# EasyEDA Pro project ProPrj_smart toll system_2026-01-20.epro

# Schematic Schematic1
Board Name: Board1; Create Date: 2025-05-15; Page Name: P1; Project Name: smart toll system; Schematic Name: Schematic1; Update Date: 2025-07-16; Company: EasyEDA.com; Page Size: A4; Version: V1.0
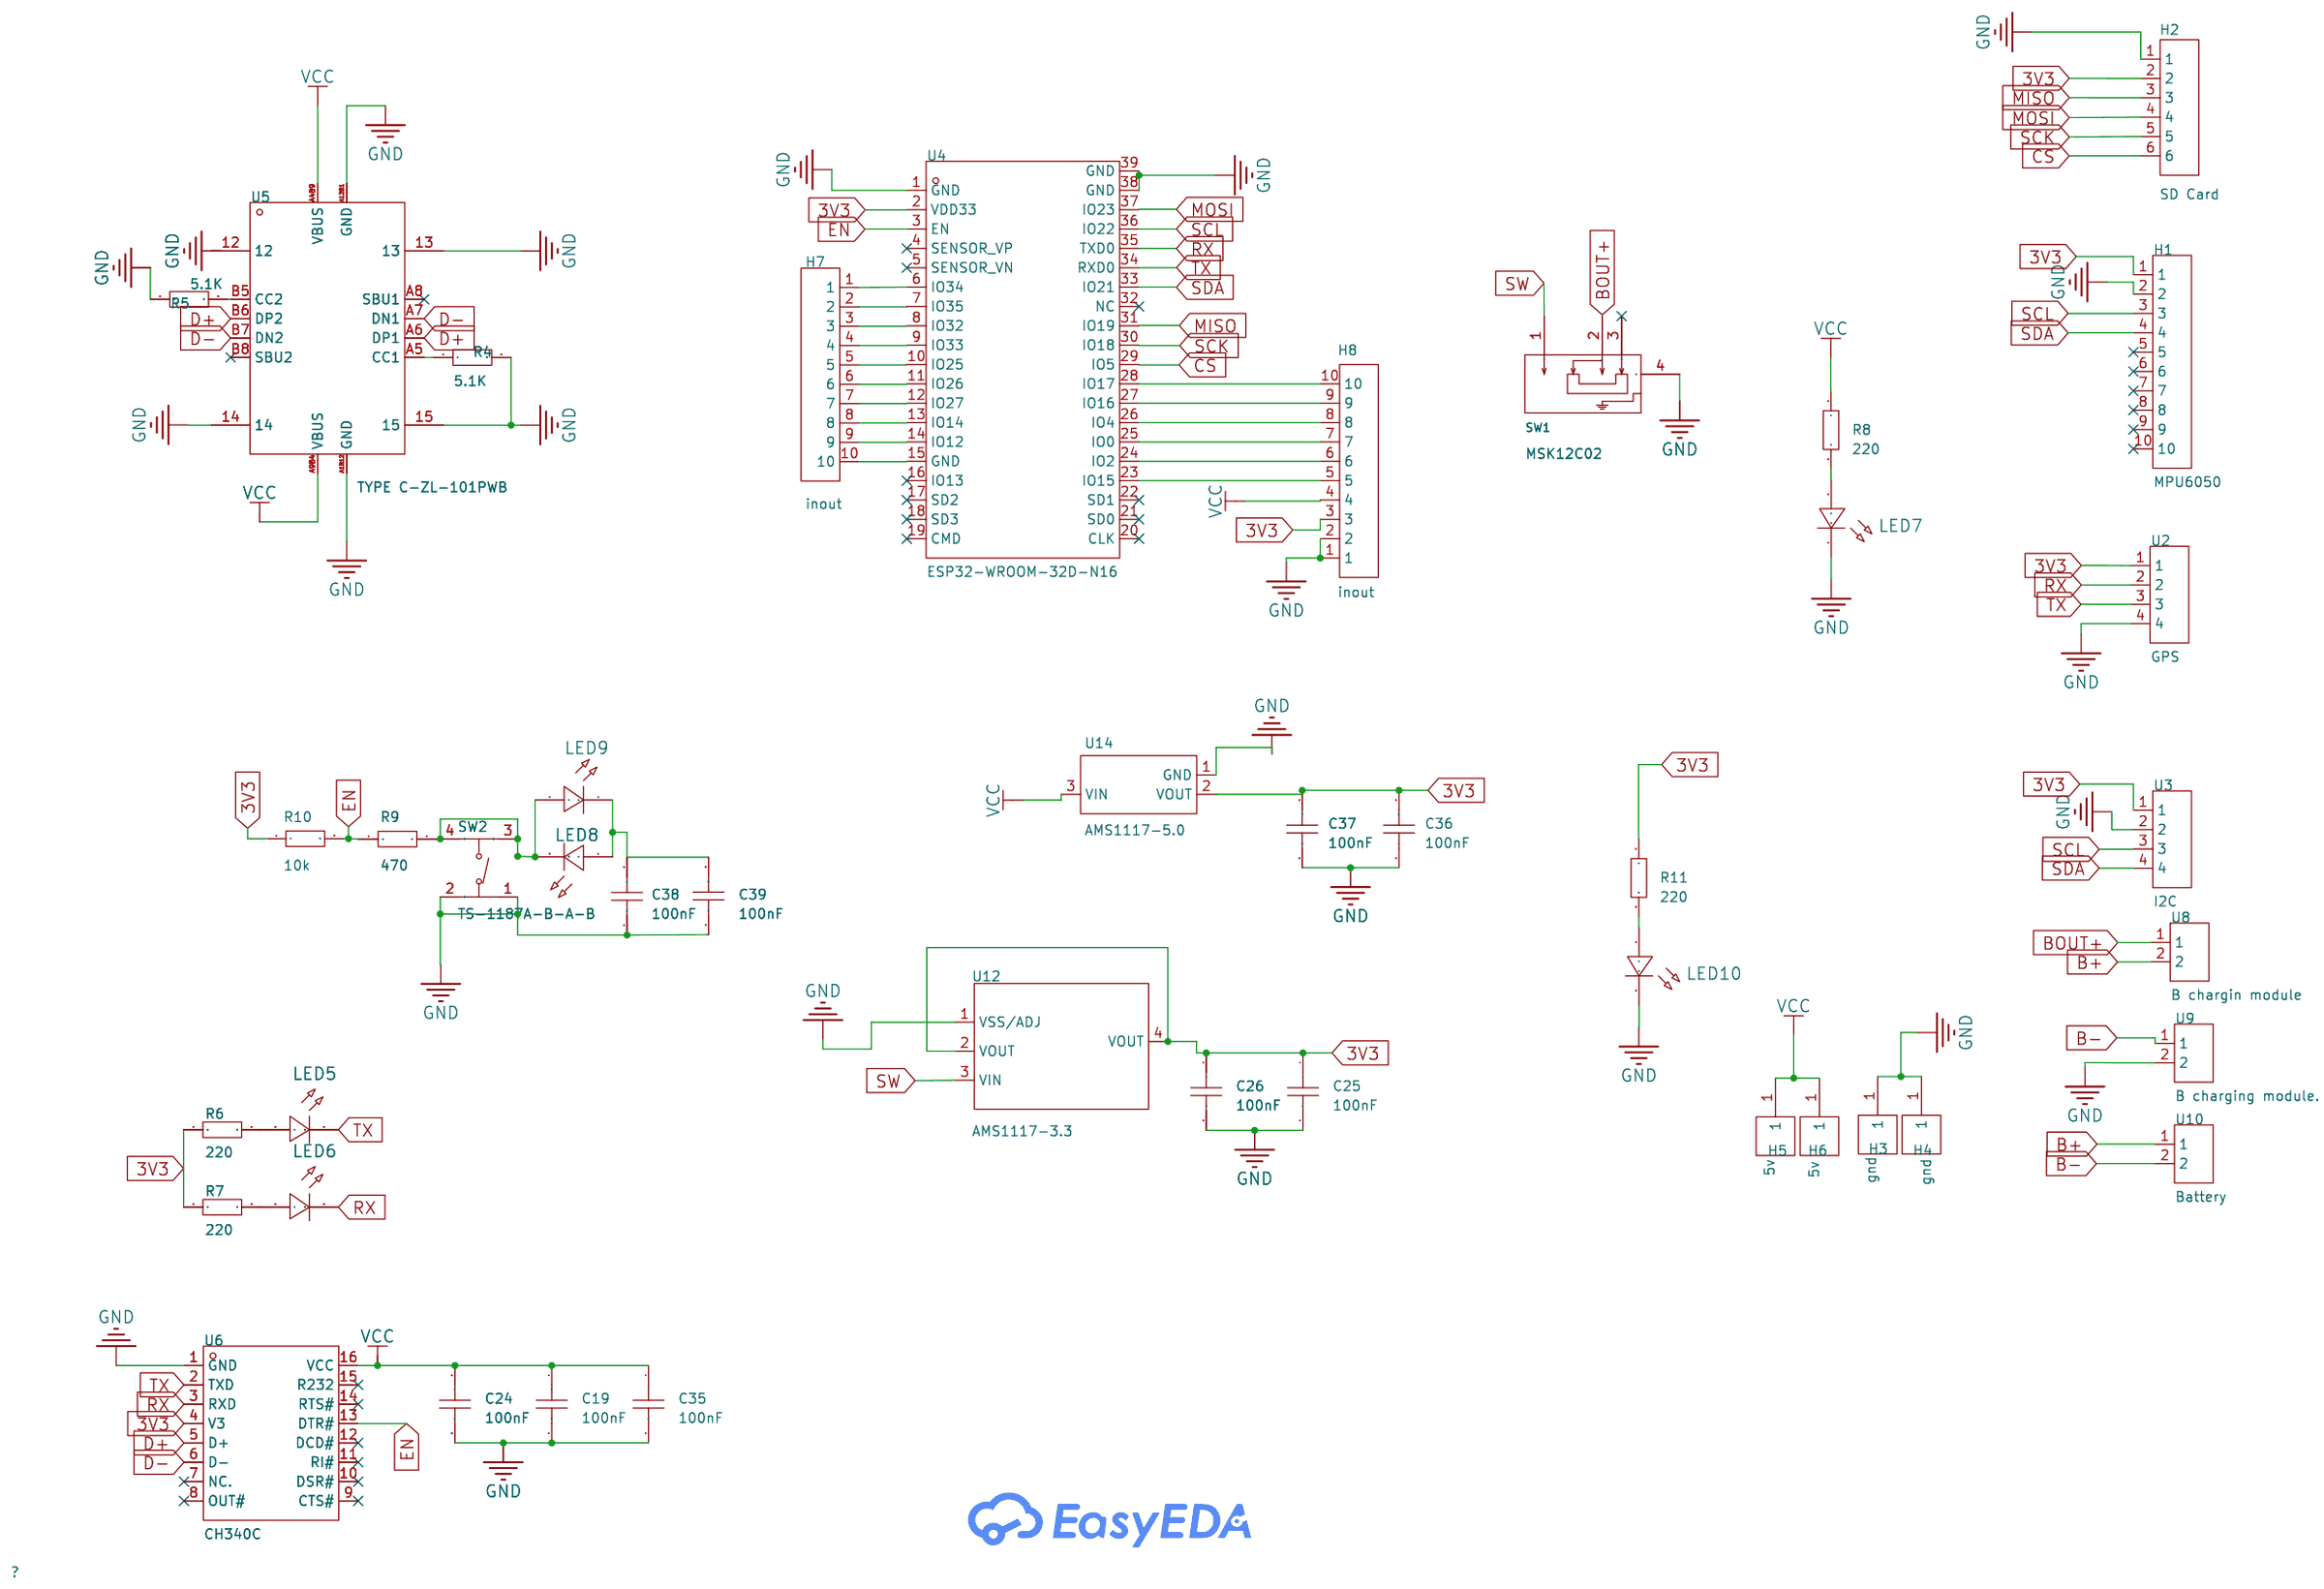
[diagram p0: schematic sheet]

## Parts
C19  100nF  [C0805]
C24  100nF  [C0805]
C25  100nF  [C0805]
C26  100nF  [C0805]
C35  100nF  [C0805]
C36  100nF  [C0805]
C37  100nF  [C0805]
C38  100nF  [C0805]
C39  100nF  [C0805]
H1  MPU6050  [HDR-TH_10P-P2.54-V-M]
H2  SD Card  [HDR-TH_6P-P2.54-V-M]
H3  gnd  [HDR-TH_1P-P2.54-V-M]
H4  gnd  [HDR-TH_1P-P2.54-V-M]
H5  5v  [HDR-TH_1P-P2.54-V-M]
H6  5v  [HDR-TH_1P-P2.54-V-M]
H7  inout  [HDR-TH_10P-P2.54-V-M]
H8  inout  [HDR-TH_10P-P2.54-V-M]
LED5  -  [LED0402-RD_YELLOW]
LED6  -  [LED0402-RD_YELLOW]
LED7  -  [LED0402-RD_YELLOW]
LED8  -  [LED0402-RD_YELLOW]
LED9  -  [LED0402-RD_YELLOW]
LED10  -  [LED0402-RD_YELLOW]
R4  5.1K  [R0603]
R5  5.1K  [R0603]
R6  220  [R0603]
R7  220  [R0603]
R8  220  [R0603]
R9  470  [R0603]
R10  10k  [R0603]
R11  220  [R0603]
SW1  MSK12C02  [SW-TH_MSK12C02]
SW2  TS-1187A-B-A-B  [SW-SMD_4P-L5.1-W5.1-P3.70-LS6.5-TL_H1.5]
U2  GPS  [HDR-TH_4P-P2.54-V-M]
U3  I2C  [HDR-TH_4P-P2.54-V-M]
U4  ESP32-WROOM-32D-N16  [WIFIM-SMD_39P-L25.5-W18.0-P1.27-BL]
U5  TYPE C-ZL-101PWB  [TYPE-C-SMD_HDGC_TYPE-C-ZL-101PWB]
U6  CH340C  [SOP-16_L10.0-W3.9-P1.27-LS6.0-BL]
U8  B chargin module  [HDR-TH_2P-P2.54-V-M]
U9  B charging module.  [HDR-TH_2P-P2.54-V-M]
U10  Battery  [HDR-TH_2P-P2.54-V-M]
U12  AMS1117-3.3  [SOT-223-3_L6.4-W3.5-P2.30-LS7.0-BR]
U14  AMS1117-5.0  [SOT-223-3_L6.7-W3.7-P2.30-LS7.0-BR_2]

## Library data of the parts
C19 C24-C26 C35-C39 = CAP_0805: Supplier Footprint: 0805
H1 H7 H8 = PZ254V-11-10P: Pin Structure:1x10P Pitch:2.54mm Row Spacing:- Circluar Pins/Square Pins:Policy Mounting Type:Straight Number of Rows:Single Row Number of Pins:10P Current Rating:- Voltage Rating (Max):- Length of Mating Pin:6mm Insulation Height:2.5mm Length of End Conn; LCSC Part Name: 1x10P 间距:2.54mm 方针 直插; Supplier Part: C492409; Manufacturer: XFCN(兴飞); Supplier Footprint: 插件,P=2.54mm; JLCPCB Part Class: Extended Part; Datasheet: https://atta.szlcsc.com/upload/public/pdf/source/20200309/C492409_129C9431BDD62EBBBD0A643B6AAB9FBD.pdf; Supplier: LCSC; Pin Structure: 1x10P; Pitch: 2.54mm; Circluar Pins/Square Pins: Policy; Mounting Type: Straight; Number of Rows: Single Row; Number of Pins: 10P; Length of Mating Pin: 6mm; Insulation Height: 2.5mm; Length of End Connection Pin: 3mm; Contact Material: Brass; Operating Temperature: -40℃~+105℃; Color: Black
H2 = PZ254V-11-06P: Pin Structure:1x6P Pitch:2.54mm Row Spacing:- Circluar Pins/Square Pins:Policy Mounting Type:Straight Number of Rows:Single Row Number of Pins:6P Current Rating:- Voltage Rating (Max):- Length of Mating Pin:6mm Insulation Height:2.5mm Length of End Connec; LCSC Part Name: 1x6P 间距:2.54mm 方针 直插; Supplier Part: C492405; Manufacturer: XFCN(兴飞); Supplier Footprint: 插件,P=2.54mm; JLCPCB Part Class: Extended Part; Datasheet: https://atta.szlcsc.com/upload/public/pdf/source/20200309/C492405_597F1930F5B55CC3C7FD95458F1C3977.pdf; Supplier: LCSC; Pin Structure: 1x6P; Pitch: 2.54mm; Circluar Pins/Square Pins: Policy; Mounting Type: Straight; Number of Rows: Single Row; Number of Pins: 6P; Length of Mating Pin: 6mm; Insulation Height: 2.5mm; Length of End Connection Pin: 3mm; Contact Material: Brass; Operating Temperature: -40℃~+105℃; Color: Black
H3-H6 = PZ254V-11-01P: Pin Structure:1x1P Pitch:2.54mm Row Spacing:- Circluar Pins/Square Pins:Policy Mounting Type:Straight Number of Rows:Single Row Number of Pins:1P Current Rating:- Voltage Rating (Max):- Length of Mating Pin:6mm Insulation Height:2.5mm Length of End Connec; LCSC Part Name: 1x1P 间距:2.54mm 方针 直插; Supplier Part: C492400; Manufacturer: XFCN(兴飞); Supplier Footprint: 插件,P=2.54mm; JLCPCB Part Class: Extended Part; Datasheet: https://atta.szlcsc.com/upload/public/pdf/source/20200309/C492400_46876A5B545F5AE6B8D4A09C46E276E8.pdf; Supplier: LCSC; Pin Structure: 1x1P; Pitch: 2.54mm; Circluar Pins/Square Pins: Policy; Mounting Type: Straight; Number of Rows: Single Row; Number of Pins: 1P; Length of Mating Pin: 6mm; Insulation Height: 2.5mm; Length of End Connection Pin: 3mm; Contact Material: Brass; Operating Temperature: -40℃~+105℃; Color: Black
LED5-LED10 = LED_0402-R: Supplier Footprint: 0402
R4-R11 = Res_0603: Supplier Footprint: 0603
SW1 = MSK12C02: Circuit:SPDT Actuator Style:- Pin Style:SMDSplicing Switch Length:8mm Switch Width:2.8mm Switch Height:1.4mm Mounting Style:卧贴 Actuator Color:- Current Rating (DC):50mA Voltage Rating (DC):12V Current Rating (AC):- Voltage Rating (AC):- Mechanical Life:1万; LCSC Part Name: 两档侧拨贴片 7脚 滑动开关; Supplier Part: C431540; Manufacturer: SHOU HAN(首韩); Supplier Footprint: SMD; JLCPCB Part Class: Extended Part; Datasheet: https://atta.szlcsc.com/upload/public/pdf/source/20190925/C431540_89155AEF0758B9AD1B2D805F83FB12E3.pdf; Supplier: LCSC; Circuit: SPDT; Pin Style: SMDSplicing; Switch Length: 8mm; Switch Width: 2.8mm; Switch Height: 1.4mm; Mounting Style: 卧贴; Current Rating (DC): 50mA; Voltage Rating (DC): 12V; Mechanical Life: 1万次; Operating Temperature: -20℃~+70℃
SW2 = TS-1187A-B-A-B: Circuit:SPST Actuator Style:Round Button Operating Force:160gf Mounting Style:Brick nogging Switch Length:5.1mm Switch Width:5.1mm Switch Height:1.5mm Strike Gundam:不带 Contact Current:50mA Voltage Rating (DC):12V Insulation Resistance:- Actuator/Cap Color; LCSC Part Name: 5.1*5.1*1.5mm 立贴 轻触开关; Supplier Part: C318884; Manufacturer: XKB Connectivity(中国星坤); Supplier Footprint: SMD; JLCPCB Part Class: Basic Part; Datasheet: https://atta.szlcsc.com/upload/public/pdf/source/20200227/C318890_053E50208A88A7BA1965D8746000774E.pdf; Supplier: LCSC; Circuit: SPST; Actuator Style: Round Button; Operating Force: 160gf; Mounting Style: Brick nogging; Switch Length: 5.1mm; Switch Width: 5.1mm; Switch Height: 1.5mm; Strike Gundam: 不带; Contact Current: 50mA; Voltage Rating (DC): 12V; Actuator/Cap Color: 金色; With Lamp: No; Mechanical Life: 10万次; Operating Temperature: -30℃~+85℃
U2 U3 = HB-PH3-25414PB2GOP: Pin Structure:1x4P Pitch:2.54mm Row Spacing:2.54mm Circluar Pins/Square Pins:Policy Mounting Type:Straight Number of Rows:Single Row Number of Pins:4P Current Rating:3A Voltage Rating (Max):250V Length of Mating Pin:6mm Insulation Height:2.54mm Length of; LCSC Part Name: 1x4P 间距:2.54mm 方针 直插; Supplier Part: C6332197; Manufacturer: HANBO(汉博); Supplier Footprint: 插件,P=2.54mm; JLCPCB Part Class: Extended Part; Datasheet: https://atta.szlcsc.com/upload/public/pdf/source/20230803/F72D259687963761DF1B552F3BB84A31.pdf; Supplier: LCSC; Pin Structure: 1x4P; Pitch: 2.54mm; Row Spacing: 2.54mm; Circluar Pins/Square Pins: Policy; Mounting Type: Straight; Number of Rows: Single Row; Number of Pins: 4P; Current Rating: 3A; Voltage Rating (Max): 250V; Length of Mating Pin: 6mm; Insulation Height: 2.54mm; Length of End Connection Pin: 3mm; Contact Material: Brass; Contact Plating: Gold; Operating Temperature: -40℃~+105℃; Color: Black
U4 = ESP32-WROOM-32D-N16: LCSC Part Name: 通用型Wi-Fi+BT+BLE MCU模组; Supplier Part: C529578; Manufacturer: ESPRESSIF(乐鑫); Supplier Footprint: SMD,18x25.5mm; JLCPCB Part Class: Extended Part; Datasheet: https://atta.szlcsc.com/upload/public/pdf/source/20200521/C529577_90A62DBC94C4A28650A646C18DE51576.pdf; Supplier: LCSC
U5 = TYPE C-ZL-101PWB: Connector Type:Type-C Number of Contacts:16P; LCSC Part Name: Type-C; Supplier Part: C5273949; Manufacturer: HDGC(华德共创); Supplier Footprint: SMD; JLCPCB Part Class: Extended Part; Datasheet: https://atta.szlcsc.com/upload/public/pdf/source/20221121/C466F9DBEFE7C046EDC432E7A2CA17E2.pdf; Supplier: LCSC; Connector Type: Type-C; Number of Contacts: 16P
U6 = CH340C: Applications Function:Transceiver Protocol: Supply Voltage:3.3V；5V Supply Voltage:3.3V；5V Data Rate:2Mbps; LCSC Part Name: CH340C USB转串口芯片 CH340; Supplier Part: C84681; Manufacturer: WCH(南京沁恒); Supplier Footprint: SOP-16; JLCPCB Part Class: Extended Part; Datasheet: https://atta.szlcsc.com/upload/public/pdf/source/20240619/63986D8440D4E5267A77ACD891CC4DE3.pdf; Supplier: LCSC; Applications Function: Transceiver; Supply Voltage: 3.3V；5V; Data Rate: 2Mbps
U8-U10 = DS1021-1x2SF11-B: Pin Structure:1x2P Pitch:2.54mm Mounting Type:Straight Number of Rows:Single Row Number of Pins:2P; LCSC Part Name: 1x2P 间距:2.54mm 直插; Supplier Part: C7430358; Manufacturer: CONNFLY; Supplier Footprint: 插件,P=2.54mm; JLCPCB Part Class: Extended Part; Datasheet: https://atta.szlcsc.com/upload/public/pdf/source/20241114/4CD35FDA5D93B3DA0275EC4D3D55EAE2.pdf; Supplier: LCSC; Pin Structure: 1x2P; Pitch: 2.54mm; Mounting Type: Straight; Number of Rows: Single Row; Number of Pins: 2P
U12 = AMS1117-3.3_C5181460: Output Type:Fixed Voltage - Supply:18V Output Voltage:3.3V Output Voltage:3.3V Output Current:1A Power Supply Rejection Ratio (PSRR):- Features:热关断(TSD) Operating Temperature:-20℃~+85℃@(Ta) Operating Temperature:-20℃~+85℃@(Ta) Output Configuration:Positiv; Supplier Part: C5181460; Manufacturer: HX(恒佳兴); Supplier Footprint: SOT-223; JLCPCB Part Class: Extended Part; Datasheet: https://atta.szlcsc.com/upload/public/pdf/source/20221124/A0FC4A7547BAED3AF8F477D5DCC568F8.pdf; Supplier: LCSC; Output Type: Fixed; Voltage - Supply: 18V; Output Voltage: 3.3V; Output Current: 1A; Features: 热关断(TSD); Operating Temperature: -20℃~+85℃@(Ta); Output Configuration: Positive electrode; Number of Outputs: 1
U14 = AMS1117-5.0_2: Output Type:Fixed Voltage - Supply:12V Output Voltage:5V Output Voltage:5V Output Current:1A Power Supply Rejection Ratio (PSRR):75dB@(120Hz) Voltage Dropout:1.2V@(1A) standby current:5mA Features:Over Current Protection；Over Temperature Protection Operat; Supplier Part: C22466223; Manufacturer: TDSEMIC(拓电半导体); Supplier Footprint: SOT-223-3L; Datasheet: https://atta.szlcsc.com/upload/public/pdf/source/20250520/831F6C1D7039ECE3F55C5820CC8FA251.pdf; Supplier: LCSC; Output Type: Fixed; Voltage - Supply: 12V; Output Voltage: 5V; Output Current: 1A; Power Supply Rejection Ratio (PSRR): 75dB@(120Hz); Voltage Dropout: 1.2V@(1A); standby current: 5mA; Features: Over Current Protection；Over Temperature Protection; Operating Temperature: -40℃~+125℃@(Tj); Output Configuration: Positive; Number of Outputs: 1

## Nets
3V3: C25.1 C26.1 C36.1 C37.1 H1.1 H2.2 H8.3 R6.1 R7.1 R10.1 U2.1 U3.1 U6.4(V3) U12.2(VOUT) U12.4(VOUT) U14.2(VOUT)
GND: C19.2 C24.2 C25.2 C26.2 C35.2 C36.2 C37.2 C38.1 C39.1 H1.2 H2.1 H3.1 H4.1 H8.1 H8.2 LED7.2(C) LED10.2(C) R4.2 R5.1 SW1.4 SW2.1(A) SW2.2(B) U2.4 U3.2 U4.1(GND) U4.38(GND) U4.39(GND) U5.12 U5.13 U5.14 U5.15 U5.A1B12(GND) U5.A12B1(GND) U6.1(GND) U12.1(VSS/ADJ) U14.1(GND)
VCC: C19.1 C24.1 C35.1 H5.1 H6.1 H8.4 U5.A4B9(VBUS) U5.A9B4(VBUS) U6.16(VCC) U14.3(VIN)
B-: U9.1
BOUT+: SW1.2
CS: H2.6
D+: U5.A6(DP1) U5.B6(DP2) U6.5(D+)
D-: U5.A7(DN1) U5.B7(DN2) U6.6(D-)
EN: R10.2 U4.3(EN) U6.13(DTR#)
MISO: H2.3
MOSI: H2.4
RX: LED6.2(C) U2.2 U4.35(TXD0) U6.3(RXD)
SCK: H2.5
SCL: H1.3
SDA: H1.4 U4.33(IO21)
SW: SW1.1 U12.3(VIN)
TX: LED5.2(C) U2.3 U4.34(RXD0) U6.2(TXD)
$1N1829: LED5.1(A) R6.2
$1N1830: LED6.1(A) R7.2
$1N3900: H7.1 U4.6(IO34)
Net-(C39-2): C39.2 LED8.1(A)
Net-(LED8-2): LED8.2(C) R9.2 SW2.3(C) SW2.4(D)
Net-(R5-2): R5.2 U5.B5(CC2)

Not connected (* = marked no-connect by the designer): C38 2; H1 5* 6* 7* 8* 9* 10*; H7 2 3 4 5 6 7 8 9 10; H8 5 6 7 8 9 10; LED7 1(A); LED9 1(A) 2(C); LED10 1(A); R4 1; R8 1 2; R9 1; R11 1 2; SW1 3*; U3 3 4; U4 2(VDD33) 4(SENSOR_VP)* 5(SENSOR_VN)* 7(IO35) 8(IO32) 9(IO33) 10(IO25) 11(IO26) 12(IO27) 13(IO14) 14(IO12) 15(GND) 16(IO13)* 17(SD2)* 18(SD3)* 19(CMD)* 20(CLK)* 21(SD0)* 22(SD1)* 23(IO15) 24(IO2) 25(IO0) 26(IO4) 27(IO16) 28(IO17) 29(IO5) 30(IO18) 31(IO19) 32(NC)* 36(IO22) 37(IO23); U5 A5(CC1) A8(SBU1)* B8(SBU2)*; U6 7(NC.)* 8(OUT#)* 9(CTS#)* 10(DSR#)* 11(RI#)* 12(DCD#)* 14(RTS#)* 15(R232)*; U8 1 2; U9 2; U10 1 2

# Board PCB1
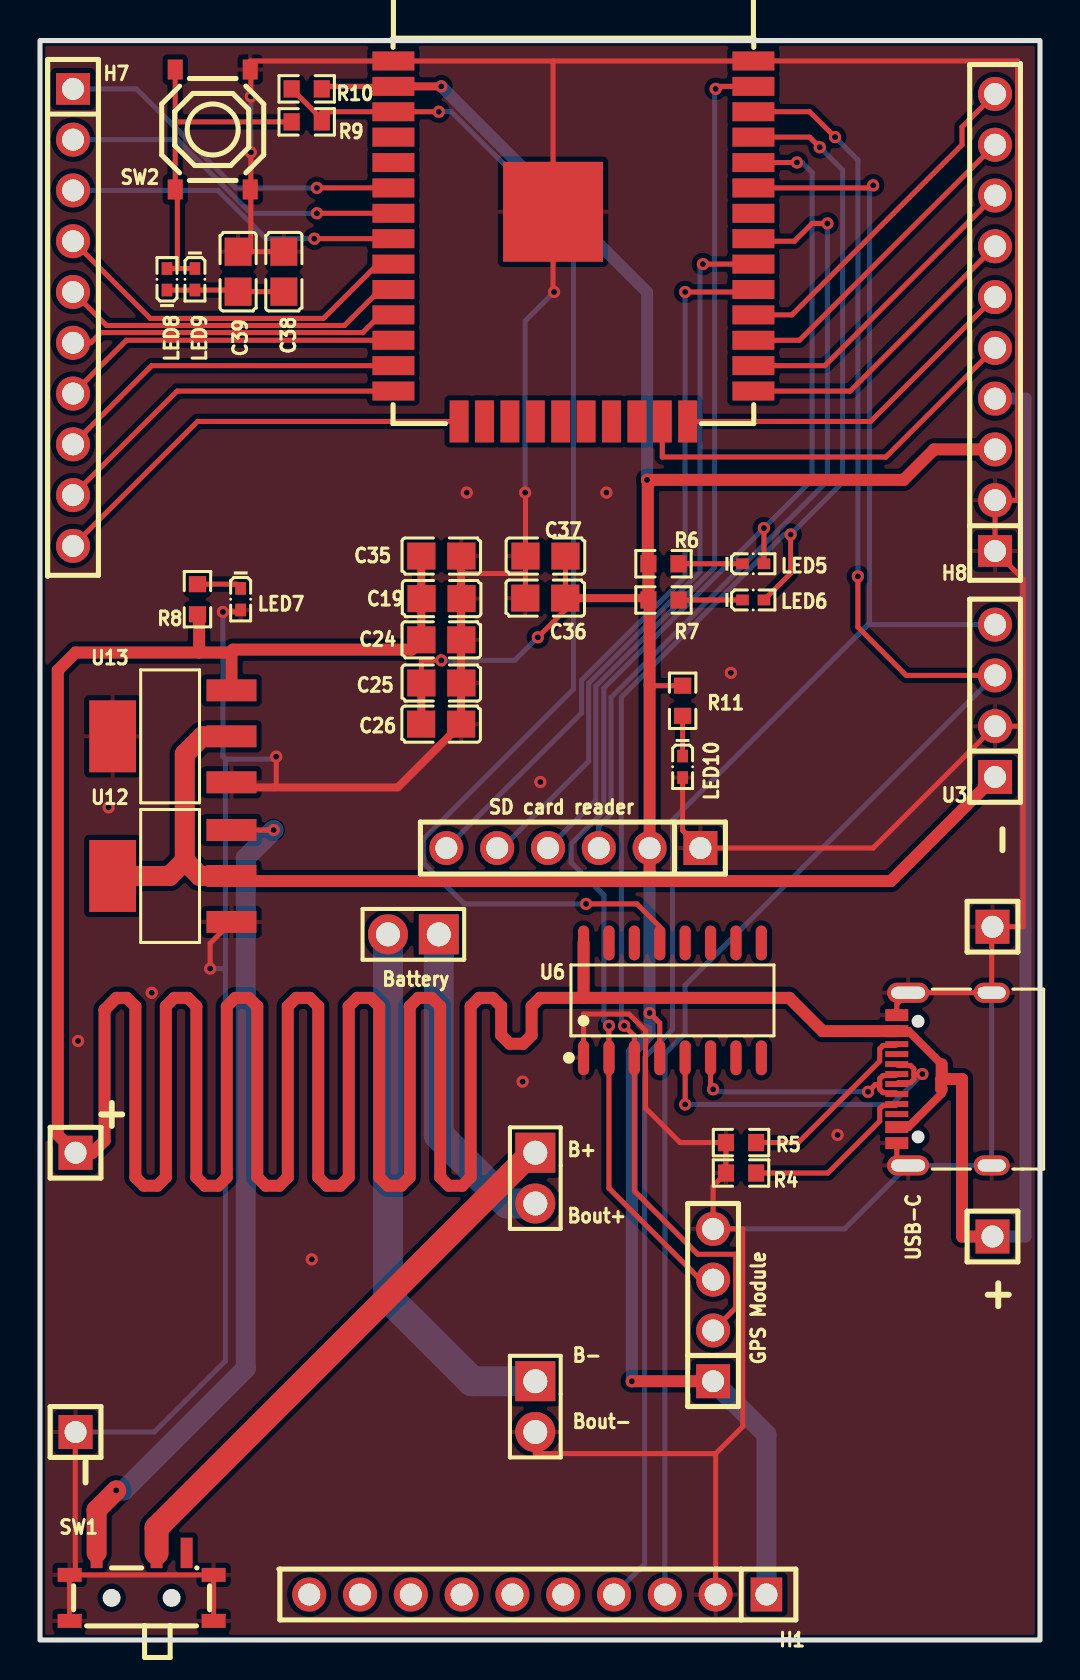
[diagram p1: board, top side]
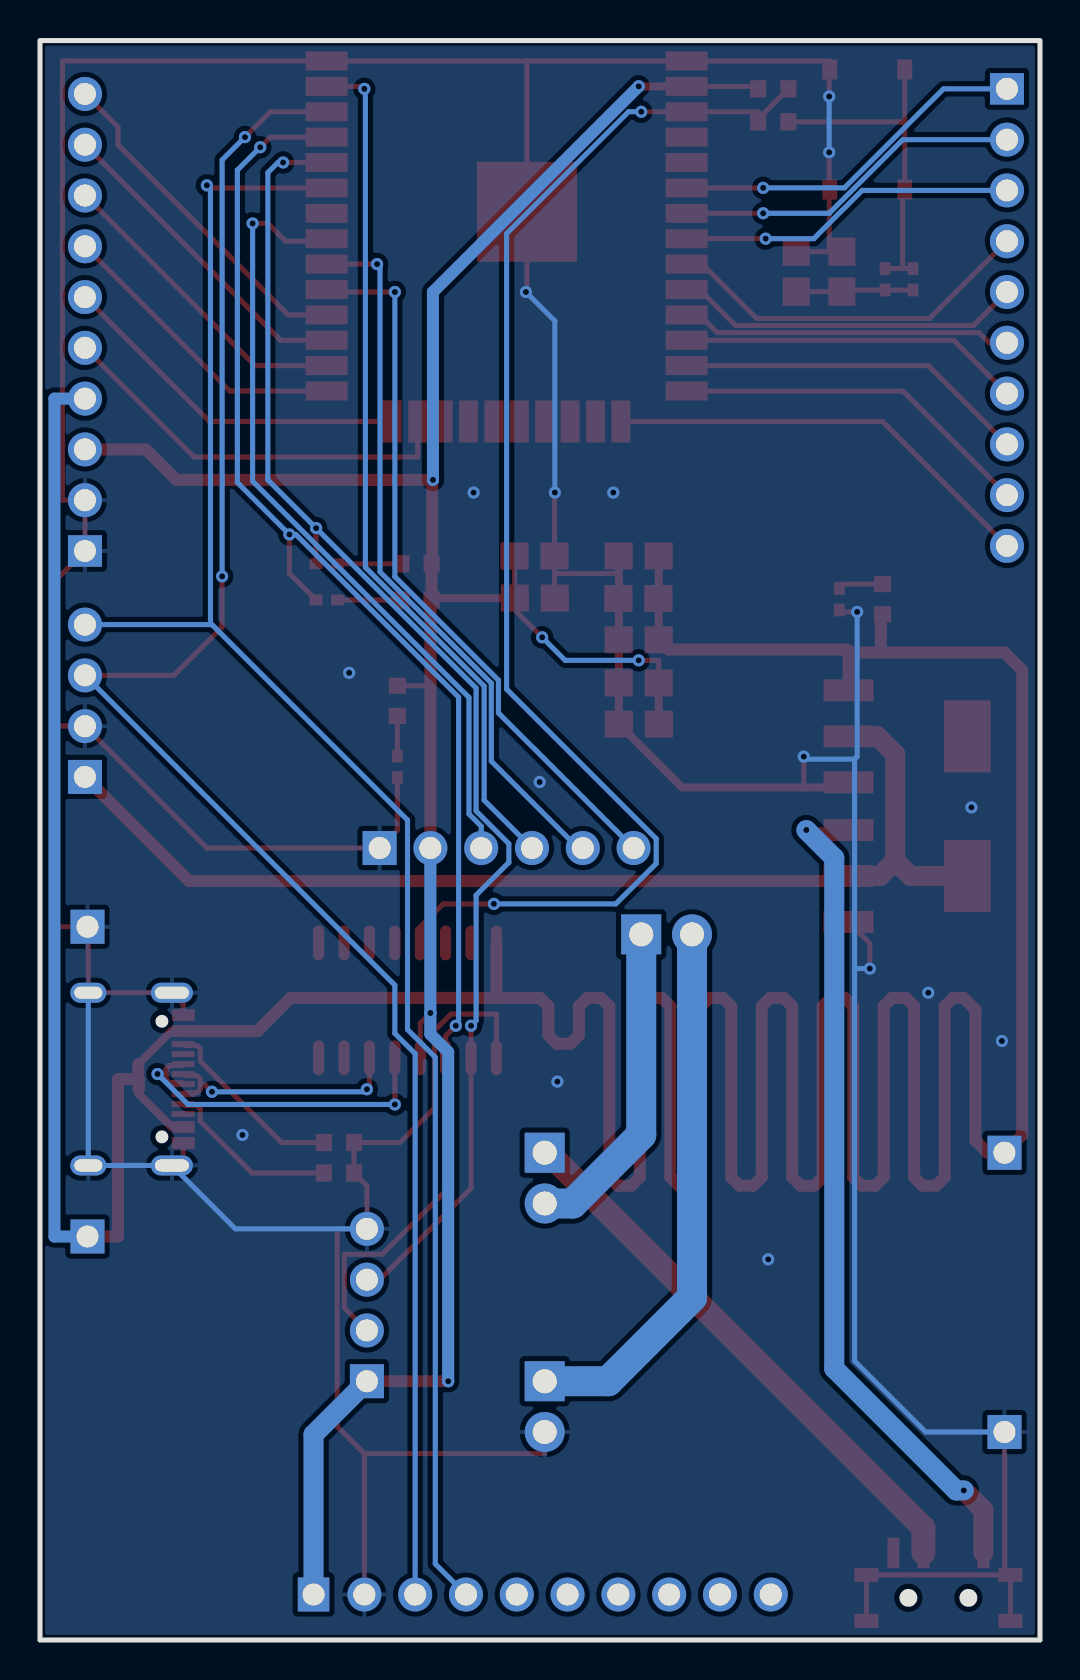
[diagram p2: board, bottom side, seen from below]

Outline 50 x 80 mm; copper layers: Top Layer, Bottom Layer. Coordinates in mm from the lower left corner of the outline.
Outline path: rectangle 0,80 50,0
Stack: Top Layer 0.035mm / Dielectric1 1.51mm FR4 er 4.5 / Bottom Layer 0.035mm

## Design rules (mm)
template: JLCPCB Capability(Two Layers Board)
spacing copperThickness1oz (default): track to track 0.102, other pairs 0.152 to 0.3
spacing copperThickness2oz: track to track 0.203, other pairs 0.152 to 0.3
track width copperThickness1oz (default): min 0.127, default 0.254, max 2.54
track width copperThickness2oz: min 0.203, default 0.254, max 2.54
differential pair differentialPair (default): width min 0.127, default 0.254, max 2.54; gap min 0.152, default 0.152
via viaSize (default): diameter min 0.5, default 0.61, max 10; hole min 0.3, default 0.305, max 6.3

## Placement (name value [footprint] x y rotation side)
+  -  [HDR-TH_1P-P2.54-V-M]  1.78 24.37 0 top
+#2  -  [HDR-TH_1P-P2.54-V-M]  47.62 20.18 0 top
-  -  [HDR-TH_1P-P2.54-V-M]  47.62 35.68 0 top
-#2  -  [HDR-TH_1P-P2.54-V-M]  1.78 10.4 0 top
B+


Bout+  -  [HDR-TH_2P-P2.54-V-M]  24.77 23.1 270 top
B-


Bout-  -  [HDR-TH_2P-P2.54-V-M]  24.77 11.67 270 top
Battery  -  [HDR-TH_2P-P2.54-V-M]  18.67 35.3 180 top
C19  100nF  [C0805]  20.08 52.09 0 top
C24  100nF  [C0805]  20.07 50.03 0 top
C25  100nF  [C0805]  20.07 47.87 0 top
C26  100nF  [C0805]  20.06 45.81 0 top
C35  100nF  [C0805]  20.07 54.22 0 top
C36  100nF  [C0805]  25.26 52.12 180 top
C37  100nF  [C0805]  25.27 54.22 180 top
C38  100nF  [C0805]  12.19 68.44 270 top
C39  100nF  [C0805]  9.91 68.44 270 top
GPS Module  -  [HDR-TH_4P-P2.54-V-M]  33.66 16.75 90 top
H1  MPU6050  [HDR-TH_10P-P2.54-V-M]  24.89 2.28 180 top
H7  inout  [HDR-TH_10P-P2.54-V-M]  1.65 66.16 270 top
H8  inout  [HDR-TH_10P-P2.54-V-M]  47.75 65.9 90 top
LED5  -  [LED0402-RD_YELLOW]  35.66 53.83 0 top
LED6  -  [LED0402-RD_YELLOW]  35.66 52.02 0 top
LED7  -  [LED0402-RD_YELLOW]  10.03 52.06 270 top
LED8  -  [LED0402-RD_YELLOW]  6.35 68.06 90 top
LED9  -  [LED0402-RD_YELLOW]  7.75 68.06 270 top
LED10  -  [LED0402-RD_YELLOW]  32.13 43.68 270 top
R4  5.1K  [R0603]  35.05 23.36 180 top
R5  5.1K  [R0603]  35.05 24.88 0 top
R6  220  [R0603]  31.17 53.83 0 top
R7  220  [R0603]  31.17 52.02 0 top
R8  220  [R0603]  7.87 52.06 90 top
R9  470  [R0603]  13.34 75.94 180 top
R10  10k  [R0603]  13.34 77.59 180 top
R11  220  [R0603]  32.13 46.98 270 top
SD card reader  -  [HDR-TH_6P-P2.54-V-M]  26.67 39.61 180 top
SW1  MSK12C02  [SW-TH_MSK12C02]  5.08 2.66 0 top
SW2  TS-1187A-B-A-B  [SW-SMD_4P-L5.1-W5.1-P3.70-LS6.5-TL_H1.5]  8.64 75.55 270 top
U3  I2C  [HDR-TH_4P-P2.54-V-M]  47.75 46.98 90 top
U4  ESP32-WROOM-32D-N16  [WIFIM-SMD_39P-L25.5-W18.0-P1.27-BL]  26.67 69.97 270 top
U6  CH340C  [SOP-16_L10.0-W3.9-P1.27-LS6.0-BL]  31.62 31.99 0 top
U12  AMS1117-3.3  [SOT-223-3_L6.4-W3.5-P2.30-LS7.0-BR]  6.6 38.22 0 top
U13  -  [SOT-223-3_L6.4-W3.5-P2.30-LS7.0-BR]  6.6 45.2 0 top
USB-C  -  [TYPE-C-SMD_HDGC_TYPE-C-ZL-101PWB]  45.21 28.06 90 top

## Footprints (pads in the part's own frame, mm; a bottom-side part is the same pattern mirrored in y, then rotated)
C0805
  rect 1.41x1.35 smd: 1(-1,0) 2(1,0)
HDR-TH_1P-P2.54-V-M
  rect 1.7x1.7 hole 1.1: 1(0,0)
HDR-TH_2P-P2.54-V-M
  rect 2x2 hole 1.2: 1(-1.27,0)
  round 2 hole 1.2: 2(1.27,0)
HDR-TH_4P-P2.54-V-M
  rect 1.7x1.7 hole 1.1: 1(-3.81,0)
  round 1.7 hole 1.1: 2(-1.27,0) 3(1.27,0) 4(3.81,0)
HDR-TH_6P-P2.54-V-M
  rect 1.7x1.7 hole 1.1: 1(-6.35,0)
  round 1.7 hole 1.1: 2(-3.81,0) 3(-1.27,0) 4(1.27,0) 5(3.81,0) 6(6.35,0)
HDR-TH_10P-P2.54-V-M
  rect 1.575x1.7 hole 1.1: 1(-11.43,0)
  round 1.7 hole 1.1: 2(-8.89,0) 3(-6.35,0) 4(-3.81,0) 5(-1.27,0) 6(1.27,0) 7(3.81,0) 8(6.35,0) 9(8.89,0) 10(11.43,0)
LED0402-RD_YELLOW
  rect 0.636x0.54 smd: 1(-0.538,0) 2(0.538,0)
R0603
  rect 0.806x0.864 smd: 1(-0.753,0) 2(0.753,0)
SOP-16_L10.0-W3.9-P1.27-LS6.0-BL
  oval 0.56x1.745 smd: 1(-4.445,-2.873) 2(-3.175,-2.873) 3(-1.905,-2.873) 4(-0.635,-2.873) 5(0.635,-2.873) 6(1.905,-2.873) 7(3.175,-2.873) 8(4.445,-2.873) 9(4.445,2.873) 10(3.175,2.873) 11(1.905,2.873) 12(0.635,2.873) 13(-0.635,2.873) 14(-1.905,2.873) 15(-3.175,2.873) 16(-4.445,2.873)
SOT-223-3_L6.4-W3.5-P2.30-LS7.0-BR
  rect 2.5x1.1 smd: 1(2.97,-2.3) 2(2.97,0) 3(2.97,2.3)
  rect 2.34x3.6 smd: 4(-2.97,0)
SW-SMD_4P-L5.1-W5.1-P3.70-LS6.5-TL_H1.5
  rect 1x0.75 smd: 1(-3,1.875) 2(3,1.875) 3(-3,-1.875) 4(3,-1.875)
SW-TH_MSK12C02
  rect 0.6x1.524 smd: 1(-2.25,1.7) 2(0.75,1.7) 3(2.25,1.7)
  rect 1.2x0.7 smd: 4(-3.6,0.6) 4(-3.6,-1.7) 4(3.6,0.6) 4(3.6,-1.7)
TYPE-C-SMD_HDGC_TYPE-C-ZL-101PWB
  oval 1x2.1 hole 0.6x1.7: 12(-4.32,1.808) 13(4.32,1.808)
  oval 1x1.8 hole 0.6x1.4: 14(-4.32,-2.373) 15(4.32,-2.373)
  rect 0.6x1.15 smd: A1B12(-3.2,2.373) A4B9(-2.4,2.373) A9B4(2.4,2.373) A12B1(3.2,2.373)
  rect 0.3x1.15 smd: A5(-1.25,2.373) A6(-0.25,2.373) A7(0.25,2.373) A8(1.25,2.373) B5(1.75,2.373) B6(0.75,2.373) B7(-0.75,2.373) B8(-1.75,2.373)
WIFIM-SMD_39P-L25.5-W18.0-P1.27-BL
  rect 0.95x2.1 smd: 1(-9.015,-9) 2(-7.745,-9) 3(-6.475,-9) 4(-5.205,-9) 5(-3.935,-9) 6(-2.665,-9) 7(-1.395,-9) 8(-0.125,-9) 9(1.145,-9) 10(2.415,-9) 11(3.685,-9) 12(4.955,-9) 13(6.225,-9) 14(7.495,-9) 25(7.495,9) 26(6.225,9) 27(4.955,9) 28(3.685,9) 29(2.415,9) 30(1.145,9) 31(-0.125,9) 32(-1.395,9) 33(-2.665,9) 34(-3.935,9) 35(-5.205,9) 36(-6.475,9) 37(-7.745,9) 38(-9.015,9)
  rect 2.1x0.95 smd: 15(9.015,-5.715) 16(9.015,-4.445) 17(9.015,-3.175) 18(9.015,-1.905) 19(9.015,-0.635) 20(9.015,0.635) 21(9.015,1.905) 22(9.015,3.175) 23(9.015,4.445) 24(9.015,5.715)
  rect 5x5 smd: 39(-1.472,-1.017)

## Nets
3V3: C25.1 C26.1 C36.1 C37.1 GPS Module.1 H1.1 H8.3 R6.1 R7.1 R10.1 R11.1 SD card reader.2 U3.1 U4.2 U6.4 U12.2 U12.4 U13.2
GND: -.1 -#2.1 B-


Bout-.2 C19.2 C24.2 C25.2 C26.2 C35.2 C36.2 C37.2 C38.1 C39.1 GPS Module.4 H1.2 H8.1 H8.2 LED7.2 LED10.2 R4.2 R5.1 SD card reader.1 SW1.4 SW2.1 SW2.2 U3.2 U4.1 U4.38 U4.39 U6.1 U12.1 U13.1 U13.4 USB-C.12 USB-C.13 USB-C.14 USB-C.15 USB-C.A1B12 USB-C.A12B1
VCC: +.1 +#2.1 C19.1 C24.1 C35.1 H8.4 R8.1 U6.16 U13.3 USB-C.A4B9 USB-C.A9B4
B+: B+


Bout+.2 Battery.1
B-: B-


Bout-.1 Battery.2
BOUT+: B+


Bout+.1 SW1.2
CS: SD card reader.6 U4.29
D+: U6.5 USB-C.A6 USB-C.B6
D-: U6.6 USB-C.A7 USB-C.B7
EN: R9.1 R10.2 U4.3 U6.13
MISO: SD card reader.3 U4.31
MOSI: SD card reader.4 U4.37
RX: GPS Module.2 LED6.2 U4.35 U6.3
SCK: SD card reader.5 U4.30
SCL: H1.3 U3.3 U4.36
SDA: H1.4 U3.4 U4.33
SW: SW1.1 U12.3
TX: GPS Module.3 LED5.2 U4.34 U6.2
$1N1239: R5.2 USB-C.B5
$1N1240: R4.1 USB-C.A5
$1N1829: LED5.1 R6.2
$1N1830: LED6.1 R7.2
$1N3154: LED7.1 R8.2
$1N3723: LED8.2 LED9.1 R9.2 SW2.3 SW2.4
$1N3900: H7.1 U4.6
$1N3906: H7.2 U4.7
$1N3910: H7.3 U4.8
$1N3915: H7.4 U4.9
$1N3920: H7.5 U4.10
$1N3925: H7.6 U4.11
$1N3930: H7.7 U4.12
$1N3935: H7.8 U4.13
$1N3940: H7.9 U4.14
$1N3945: H7.10 U4.15
$1N4020: H8.10 U4.28
$1N4025: H8.9 U4.27
$1N4031: H8.8 U4.26
$1N4037: H8.7 U4.25
$1N4043: H8.6 U4.24
$1N4049: H8.5 U4.23
$1N5533: C38.2 C39.2 LED8.1 LED9.2
$1N8172: LED10.1 R11.2

Pads without a net: H1 5 6 7 8 9 10; SW1 3; U4 4 5 16 17 18 19 20 21 22 32; U6 7 8 9 10 11 12 14 15; USB-C A8 B8

## Via types
v1: diameter 0.61, hole 0.305, Top Layer to Bottom Layer, 47 vias

## Routing (per net, layer and track width the routed paths; a pad name or vN(x,y) marks a point on that pad's centre or on a via; arc(x,y) is an arc through that point)
3V3: length 188.5
  Top Layer w0.254: v1(24.89,50.15) 26.26,51.53 C36.1 26.27,52.13 C37.1 ; U6.4 30.99,30.86 v1(30.48,31.36) ; C25.1 19.07,49 v1(20.07,49) ; R11.1 30.51,47.73 30.48,47.77 ; U4.2 14.21,77.71 R10.1
  Top Layer w0.4: C36.1 30.33,52.12 R7.1 ; U4.2 v1(20.07,77.71) ; C25.1 19.07,45.82 C26.1
  Top Layer w0.6: U12.2 9.83,37.96 30.48,37.96 ; 30.48,37.96 42.55,37.96 U3.1 ; 30.48,37.96 30.48,51.96 R7.1 R6.1 30.39,53.86 30.39,57.93 30.42,57.96 ; H8.3 44.7,59.55 43.18,58.03 30.42,58.03 30.42,57.96 ; 30.42,57.96 v1(30.35,58.03) ; v1(29.59,12.94) GPS Module.1
  Top Layer w1: 7.24,38.98 7.24,44.31 8.13,45.2 U13.2 ; 7.24,38.98 6.48,38.22 U12.4 ; 7.24,38.98 8,38.22 U12.2
  Bottom Layer w0.254: v1(24.89,50.15) 23.74,49 v1(20.07,49)
  Bottom Layer w0.6: 30.48,39.61 v1(30.48,31.36) 30.48,30.3 29.59,29.41 v1(29.59,12.94) ; v1(20.07,77.71) 30.35,67.42 v1(30.35,58.03)
  Bottom Layer w1: GPS Module.1 36.32,10.28 H1.1
GND: length 329.8
  Top Layer w0.254: -#2.1 1.76,10.39 1.76,3.51 1.51,3.26 ; 25.65,78.98 U4.38 35.67,78.98 48.88,78.98 48.88,57.01 H8.2 H8.1 49.15,53.08 49.15,45.71 ; 25.65,78.98 U4.1 10.51,78.98 SW2.1 10.54,78.52 v1(10.54,77.21) ; 25.65,78.98 U4.39 25.65,67.48 v1(25.71,67.43) ; 24.27,53.35 24.27,52.13 C36.2 ; 24.27,53.35 21.07,53.35 ; 24.27,53.35 C37.2 24.27,57.38 v1(24.26,57.39) ; LED7.2 9.94,51.42 v1(9.14,51.42) ; 1.51,3.26 SW1.4 SW1.4 ; 1.51,3.26 1.48,3.26 1.48,0.96 ; v1(10.54,74.41) 10.54,72.58 SW2.2 10.54,72.52 10.54,69.51 10.6,69.44 ; 24.77,10.4 24.77,9.32 33.78,9.32 ; 11.72,42.65 11.81,42.73 v1(11.81,44.19) ; v1(8.51,33.58) 8.51,34.85 U12.1 ; 33.78,9.32 H1.2 ; 33.78,9.32 35.14,10.68 35.14,20.56 GPS Module.4 33.66,22.71 R4.2 R5.1 32,24.88 30.28,26.61 30.28,30.48 29.45,31.31 27.18,31.31 U6.1 ; 49.15,45.71 U3.2 41.66,39.61 SD card reader.1 32.13,40.5 LED10.2 ; 49.15,45.71 49.15,35.68 -.1 47.58,35.64 USB-C.15 USB-C.13 42.84,31.81 USB-C.A12B1 ; USB-C.A1B12 42.84,23.74 USB-C.12 ; C38.1 10.6,69.44 ; 10.6,69.44 C39.1
  Top Layer w0.4: C35.2 21.07,54.49 21.06,54.48 C26.2 17.89,42.65 9.83,42.65 U13.1
  Bottom Layer w0.254: -#2.1 5.72,10.4 9.27,13.96 9.27,33.58 ; v1(11.81,44.19) 11.68,44.06 9.27,44.06 ; GPS Module.4 40.23,20.56 USB-C.12 USB-C.14 USB-C.15 ; 9.27,33.58 9.27,44.06 ; 9.27,33.58 v1(8.51,33.58) ; v1(9.14,51.42) 9.14,44.19 9.27,44.06 ; v1(25.71,67.43) 24.26,65.98 v1(24.26,57.39) ; v1(10.54,77.21) v1(10.54,74.41)
  vias: v1(1.91,29.96) v1(3.43,41.65) v1(5.59,32.37) v1(13.59,19.04) v1(21.34,57.39) v1(24.13,27.93) v1(25.02,42.92) v1(28.32,57.39) v1(34.54,48.38) v1(39.88,25.26)
VCC: length 276.2
  Top Layer w0.4: USB-C.A4B9 43.41,25.66 45.09,27.33 45.09,27.55 ; 45.09,28.8 43.43,30.46 USB-C.A9B4 ; C24.1 C35.1
  Top Layer w0.6: R8.1 7.96,51.22 7.96,49.39 ; 9.51,49.39 9.57,49.33 U13.3 ; 9.51,49.39 7.96,49.39 ; 9.51,49.39 9.65,49.54 18.58,49.54 C24.1 ; 7.96,49.39 1.78,49.39 0.89,48.5 0.89,25.26 +.1 2.63,24.37 3.23,24.97 3.23,31.52 3.83,32.12 4.34,32.12 4.77,31.7 4.77,23.15 5.19,22.72 5.87,22.72 6.29,23.15 6.29,31.7 6.72,32.12 7.39,32.12 7.82,31.7 7.82,23.15 8.24,22.72 8.92,22.72 9.34,23.15 9.34,31.7 9.76,32.12 10.44,32.12 10.86,31.7 10.86,23.15 11.29,22.72 11.96,22.72 12.39,23.15 12.39,31.7 12.81,32.12 13.49,32.12 13.91,31.7 13.91,23.15 14.34,22.72 15.01,22.72 15.44,23.15 15.44,31.7 15.86,32.12 16.54,32.12 16.96,31.7 16.96,23.15 17.38,22.72 18.06,22.72 18.48,23.15 18.48,31.7 18.91,32.12 19.58,32.12 20.01,31.7 20.01,23.15 20.43,22.72 21.11,22.72 21.53,23.15 21.53,31.7 21.96,32.12 22.63,32.12 23.06,31.7 23.06,30.25 23.48,29.83 24.16,29.83 24.58,30.25 24.58,31.7 25,32.12 27.18,32.12 ; 45.09,27.55 45.06,27.57 45.06,28.03 45.09,28.06 ; 45.09,28.06 46.1,28.06 46.1,20.18 +#2.1 ; 45.09,28.06 45.09,28.8 ; 27.18,32.12 37.47,32.12 39.13,30.46 USB-C.A9B4 ; 27.18,32.12 U6.16
  Bottom Layer w0.6: H8.4 49.28,62.09 49.28,20.18 +#2.1
B+: length 16.3
  Bottom Layer w1.5: Battery.1 19.94,25.26 23.37,21.83 B+


Bout+.2
B-: length 27.3
  Bottom Layer w1.5: B-


Bout-.1 21.59,12.94 17.4,17.13 Battery.2
BOUT+: length 28
  Top Layer w1.2: SW1.2 5.83,5.61 24.59,24.37 B+


Bout+.1
CS: length 36.2
  Top Layer w0.254: v1(32.26,67.43) 35.55,67.43 35.67,67.55
  Bottom Layer w0.254: v1(32.26,67.43) 32.26,53.19 27.08,48.01 27.08,46.37 20.32,39.61
D+: length 17.8
  Top Layer w0.254: v1(44.12,28.31) 44.18,28.31 44.2,28.29 43.69,28.29 ; 43.69,28.29 43.69,28.57 43.53,28.74 42.91,28.74 USB-C.B6 ; 43.69,28.29 43.69,28.04 43.53,27.88 42.91,27.88 USB-C.A6 ; v1(32.26,26.79) 32.26,29.12
  Bottom Layer w0.254: v1(32.26,26.79) 42.6,26.79 v1(44.12,28.31)
D-: length 12.6
  Top Layer w0.254: 41.99,27.78 41.99,28.07 42.15,28.24 42.77,28.24 USB-C.A7 ; 41.99,27.78 41.76,27.78 v1(41.4,27.42) ; 41.99,27.78 41.99,27.54 42.15,27.38 42.77,27.38 USB-C.B7 ; v1(33.66,27.55) 33.53,27.68 U6.6
  Bottom Layer w0.254: v1(41.4,27.42) 33.78,27.42 v1(33.66,27.55)
EN: length 66.3
  Top Layer w0.254: v1(19.94,76.44) U4.3 14.09,76.44 14.09,76.08 ; 14.09,76.08 R9.1 ; 14.09,76.08 R10.2 ; v1(27.31,36.82) 29.84,36.82 30.99,35.68 U6.13
  Bottom Layer w0.254: v1(19.94,76.44) 20.57,76.44 26.67,70.35 26.67,47.56 19.19,40.08 19.19,38.84 21.21,36.82 v1(27.31,36.82)
MISO: length 40.1
  Top Layer w0.254: U4.31 35.8,69.97 37.72,69.97 38.61,70.86 v1(39.37,70.86)
  Bottom Layer w0.254: 27.94,39.61 27.94,40.71 28.55,41.32 28.55,47.14 39.37,57.96 v1(39.37,70.86)
MOSI: length 43.4
  Top Layer w0.254: v1(33.78,77.59) 33.91,77.71 U4.37
  Bottom Layer w0.254: v1(33.78,77.59) 33.73,77.54 33.73,53.66 27.79,47.72 27.79,42 SD card reader.4
RX: length 75.7
  Top Layer w0.254: 35.67,75.17 38.48,75.17 v1(38.99,74.67) ; v1(29.21,30.72) 29.72,30.22 U6.3 29.72,22.46 32.89,19.29 34.78,19.29 34.78,16.61 GPS Module.2 ; LED6.2 37.53,53.35 v1(37.53,55.3)
  Bottom Layer w0.254: v1(29.21,30.72) 29.07,30.86 29.07,47.16 37.21,55.3 v1(37.53,55.3) 40.13,57.9 40.13,73.52 v1(38.99,74.67)
SCK: length 36.1
  Top Layer w0.254: U4.30 v1(33.15,68.82)
  Bottom Layer w0.254: v1(33.15,68.82) 33,68.67 33,53.43 27.44,47.86 27.44,43.96 23.09,39.61 SD card reader.5
SCL: length 90.3
  Top Layer w0.254: U3.3 43.31,48.25 40.89,50.66 v1(40.89,53.2) ; U4.36 38.48,76.44 v1(39.75,75.17)
  Bottom Layer w0.254: U3.3 32.26,32.76 32.26,30.34 31.24,29.33 H1.3 ; v1(39.75,75.17) 40.89,74.03 v1(40.89,53.2)
SDA: length 88.2
  Top Layer w0.254: v1(41.66,72.76) 41.53,72.63 U4.33
  Bottom Layer w0.254: v1(41.66,72.76) 41.48,72.58 41.48,50.79 ; U3.4 41.48,50.79 ; 41.48,50.79 41.4,50.79 31.62,41.01 31.62,30.54 30.24,29.15 30.24,3.81 H1.4
SW: length 42.2
  Top Layer w0.254: v1(11.68,40.52) U12.3
  Top Layer w1: v1(3.81,7.48) 2.83,6.5 SW1.1
  Bottom Layer w1: v1(3.81,7.48) 4.19,7.48 10.29,13.58 10.29,39.12 v1(11.68,40.52)
TX: length 68.6
  Top Layer w0.254: v1(28.45,30.72) U6.2 28.45,22.6 33.02,18.02 GPS Module.3 ; v1(37.85,73.9) 37.84,73.9 U4.34 ; v1(36.19,55.62) 36.2,55.61 LED5.2
  Bottom Layer w0.254: v1(37.85,73.9) 38.1,73.9 38.61,73.4 38.61,58.03 v1(36.19,55.62) 28.19,47.61 28.19,41.46 26.56,39.83 26.56,38.89 28.19,37.26 28.19,30.98 v1(28.45,30.72)
$1N1239: length 9.4
  Top Layer w0.254: USB-C.B5 42.77,29.74 42.15,29.74 41.99,29.57 41.99,28.95 37.91,24.88 R5.2
$1N1240: length 8.8
  Top Layer w0.254: R4.1 39.39,23.36 41.99,25.95 41.99,26.57 42.15,26.74 42.77,26.74 USB-C.A5
$1N1829: length 3.2
  Top Layer w0.254: R6.2 35.12,53.83
$1N1830: length 3.2
  Top Layer w0.254: R7.2 35.12,52.02
$1N3154: length 2.2
  Top Layer w0.254: LED7.1 9.82,52.81 R8.2
$1N3723: length 17.2
  Top Layer w0.254: 6.87,68.6 LED9.1 ; 6.87,68.6 LED8.2 ; 6.87,68.6 6.87,72.45 SW2.4 6.76,75.94 ; R9.2 6.76,75.94 ; 6.76,75.94 SW2.3
$1N3900: length 18.1
  Top Layer w0.254: v1(13.84,72.63) 17.67,72.63 U4.6
  Bottom Layer w0.254: v1(13.84,72.63) 9.78,72.63 4.83,77.59 H7.1
$1N3906: length 17.5
  Top Layer w0.254: v1(13.84,71.36) 17.67,71.36 U4.7
  Bottom Layer w0.254: v1(13.84,71.36) 10.54,71.36 6.86,75.05 H7.2
$1N3910: length 17
  Top Layer w0.254: U4.8 17.67,70.09 v1(13.72,70.09)
  Bottom Layer w0.254: H7.3 8.89,72.51 11.31,70.09 v1(13.72,70.09)
$1N3915: length 18.7
  Top Layer w0.254: H7.4 5.51,66.11 14.17,66.11 16.89,68.82 U4.9
$1N3920: length 17.5
  Top Layer w0.254: 17.67,67.55 17.02,67.55 15.22,65.75 3.33,65.75 H7.5
$1N3925: length 16.6
  Top Layer w0.254: U4.11 17.02,66.28 16.13,65.39 3.05,65.39 2.54,64.89 H7.6
$1N3930: length 17.1
  Top Layer w0.254: U4.12 4.32,65.01 H7.7
$1N3935: length 17.6
  Top Layer w0.254: U4.13 5.59,63.74 H7.8
$1N3940: length 18.2
  Top Layer w0.254: 17.67,62.47 6.86,62.47 H7.9
$1N3945: length 21.9
  Top Layer w0.254: U4.15 7.88,60.95 H7.10
$1N4020: length 17.2
  Top Layer w0.254: U4.28 37.59,66.28 46.1,74.79 46.1,75.68 H8.10
$1N4025: length 16.1
  Top Layer w0.254: H8.9 37.97,65.01 U4.27
$1N4031: length 15.6
  Top Layer w0.254: H8.8 39.24,63.74 U4.26
$1N4037: length 15.1
  Top Layer w0.254: 35.67,62.47 40.51,62.47 H8.7
$1N4043: length 17.9
  Top Layer w0.254: H8.6 41.53,60.95 U4.24
$1N4049: length 20.7
  Top Layer w0.254: H8.5 42.29,59.17 31.12,59.17 U4.23
$1N5533: length 5.9
  Top Layer w0.254: C38.2 C39.2 9.82,67.52 LED9.2 LED8.1
$1N8172: length 2
  Top Layer w0.254: R11.2 LED10.1

## Copper pours and planes (outline as drawn; the poured copper is in the pictures)
GND on Top Layer: 0,80 50,80 50,0 0,0
GND on Bottom Layer: 0,80 50,80 50,0 0,0
